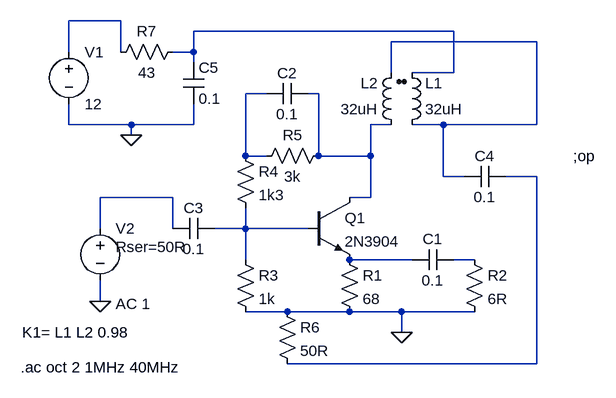
[diagram p0: schematic Feedback amp 2.asc]
Feedback amp 2.asc, the LTspice schematic file:
Version 4
SHEET 1 880 680
WIRE 144 224 240 224
WIRE 304 224 336 224
WIRE 336 304 224 304
WIRE 144 304 48 304
WIRE -16 144 -16 176
WIRE 80 176 -16 176
WIRE -16 176 -16 224
WIRE -16 64 16 64
WIRE 16 -32 -16 -32
WIRE -16 -32 -16 64
WIRE 96 64 96 -32
WIRE 96 -32 80 -32
WIRE -16 176 -64 176
WIRE 176 128 144 128
WIRE 96 64 176 64
WIRE 176 64 176 128
WIRE 48 304 -16 304
WIRE 48 384 432 384
WIRE 432 96 384 96
WIRE -208 -96 -208 -144
WIRE -208 -144 -288 -144
WIRE -288 -144 -288 -96
WIRE -96 -80 -96 -96
WIRE -96 -96 -128 -96
WIRE -240 176 -240 128
WIRE -128 128 -128 176
WIRE -96 -16 -96 16
WIRE -96 16 -192 16
WIRE -288 16 -288 -16
WIRE -192 32 -192 16
WIRE -192 16 -288 16
WIRE -240 288 -240 256
WIRE 224 336 224 304
WIRE 224 304 144 304
WIRE -128 128 -240 128
WIRE 432 96 432 384
WIRE 288 96 320 96
WIRE -96 -128 -96 -96
WIRE -96 -128 304 -128
WIRE 304 -128 304 -64
WIRE 208 -64 208 -112
WIRE 208 -112 432 -112
WIRE 432 -112 432 16
WIRE 432 16 288 16
WIRE 208 16 176 16
WIRE 176 16 176 64
WIRE 288 96 288 16
WIRE 288 16 240 16
WIRE 304 -64 240 -64
FLAG 224 336 0
FLAG -240 288 0
FLAG -192 32 0
SYMBOL npn 80 128 R0
SYMATTR InstName Q1
SYMATTR Value 2N3904
SYMBOL res 128 208 R0
SYMATTR InstName R1
SYMATTR Value 68
SYMBOL cap 304 208 R90
WINDOW 0 0 32 VBottom 0
WINDOW 3 32 32 VTop 0
SYMATTR InstName C1
SYMATTR Value 0.1
SYMBOL res 320 208 R0
SYMATTR InstName R2
SYMATTR Value 6R
SYMBOL res -32 208 R0
SYMATTR InstName R3
SYMATTR Value 1k
SYMBOL res -32 48 R0
SYMATTR InstName R4
SYMATTR Value 1k3
SYMBOL res 0 80 R270
WINDOW 0 32 56 VTop 0
WINDOW 3 0 56 VBottom 0
SYMATTR InstName R5
SYMATTR Value 3k
SYMBOL cap 16 -16 R270
WINDOW 0 32 32 VTop 0
WINDOW 3 0 32 VBottom 0
SYMATTR InstName C2
SYMATTR Value 0.1
SYMBOL cap -64 160 R90
WINDOW 0 0 32 VBottom 0
WINDOW 3 32 32 VTop 0
SYMATTR InstName C3
SYMATTR Value 0.1
SYMBOL cap 384 80 R90
WINDOW 0 0 32 VBottom 0
WINDOW 3 32 32 VTop 0
SYMATTR InstName C4
SYMATTR Value 0.1
SYMBOL res 32 288 R0
SYMATTR InstName R6
SYMATTR Value 50R
SYMBOL cap -112 -80 R0
SYMATTR InstName C5
SYMATTR Value 0.1
SYMBOL res -112 -112 R90
WINDOW 0 0 56 VBottom 0
WINDOW 3 32 56 VTop 0
SYMATTR InstName R7
SYMATTR Value 43
SYMBOL voltage -288 -112 R0
WINDOW 123 0 0 Left 0
WINDOW 39 0 0 Left 0
SYMATTR InstName V1
SYMATTR Value 12
SYMBOL voltage -240 160 R0
WINDOW 123 24 132 Left 0
WINDOW 39 24 44 Left 0
SYMATTR Value2 AC 1
SYMATTR SpiceLine Rser=50R
SYMATTR InstName V2
SYMATTR Value ""
SYMBOL ind2 224 32 M180
WINDOW 0 36 80 Left 0
WINDOW 3 36 40 Left 0
SYMATTR InstName L1
SYMATTR Value 32uH
SYMATTR Type ind
SYMATTR SpiceLine Rser=1
SYMBOL ind2 224 32 R180
WINDOW 0 36 80 Left 0
WINDOW 3 36 40 Left 0
SYMATTR InstName L2
SYMATTR Value 32uH
SYMATTR Type ind
SYMATTR SpiceLine Rser=1
TEXT -360 336 Left 0 !K1= L1 L2 0.98
TEXT -362 390 Left 0 !.ac oct 2 1MHz 40MHz
TEXT 488 64 Left 0 !;op

The netlist it stands for:
* Feedback amp 2.asc
Q1 N005 N003 N001 0 2N3904
R1 N001 0 68
C1 N002 N001 0.1
R2 N002 0 6R
R3 N003 0 1k
R4 N004 N003 1k3
R5 N004 N005 3k
C2 N004 N005 0.1
C3 N003 N009 0.1
C4 N006 N010 0.1
R6 0 N006 50R
C5 N008 0 0.1
R7 N008 N007 43
V1 N007 0 12
V2 N009 0 AC 1 Rser=50R
L1 N010 N008 32uH Rser=1
L2 N005 N010 32uH Rser=1
.model NPN NPN
.model PNP PNP
.lib standard.bjt
K1= L1 L2 0.98
.ac oct 2 1MHz 40MHz
;op
.backanno
.end